# EAGLE design untitled (EAGLE 9.6.2)
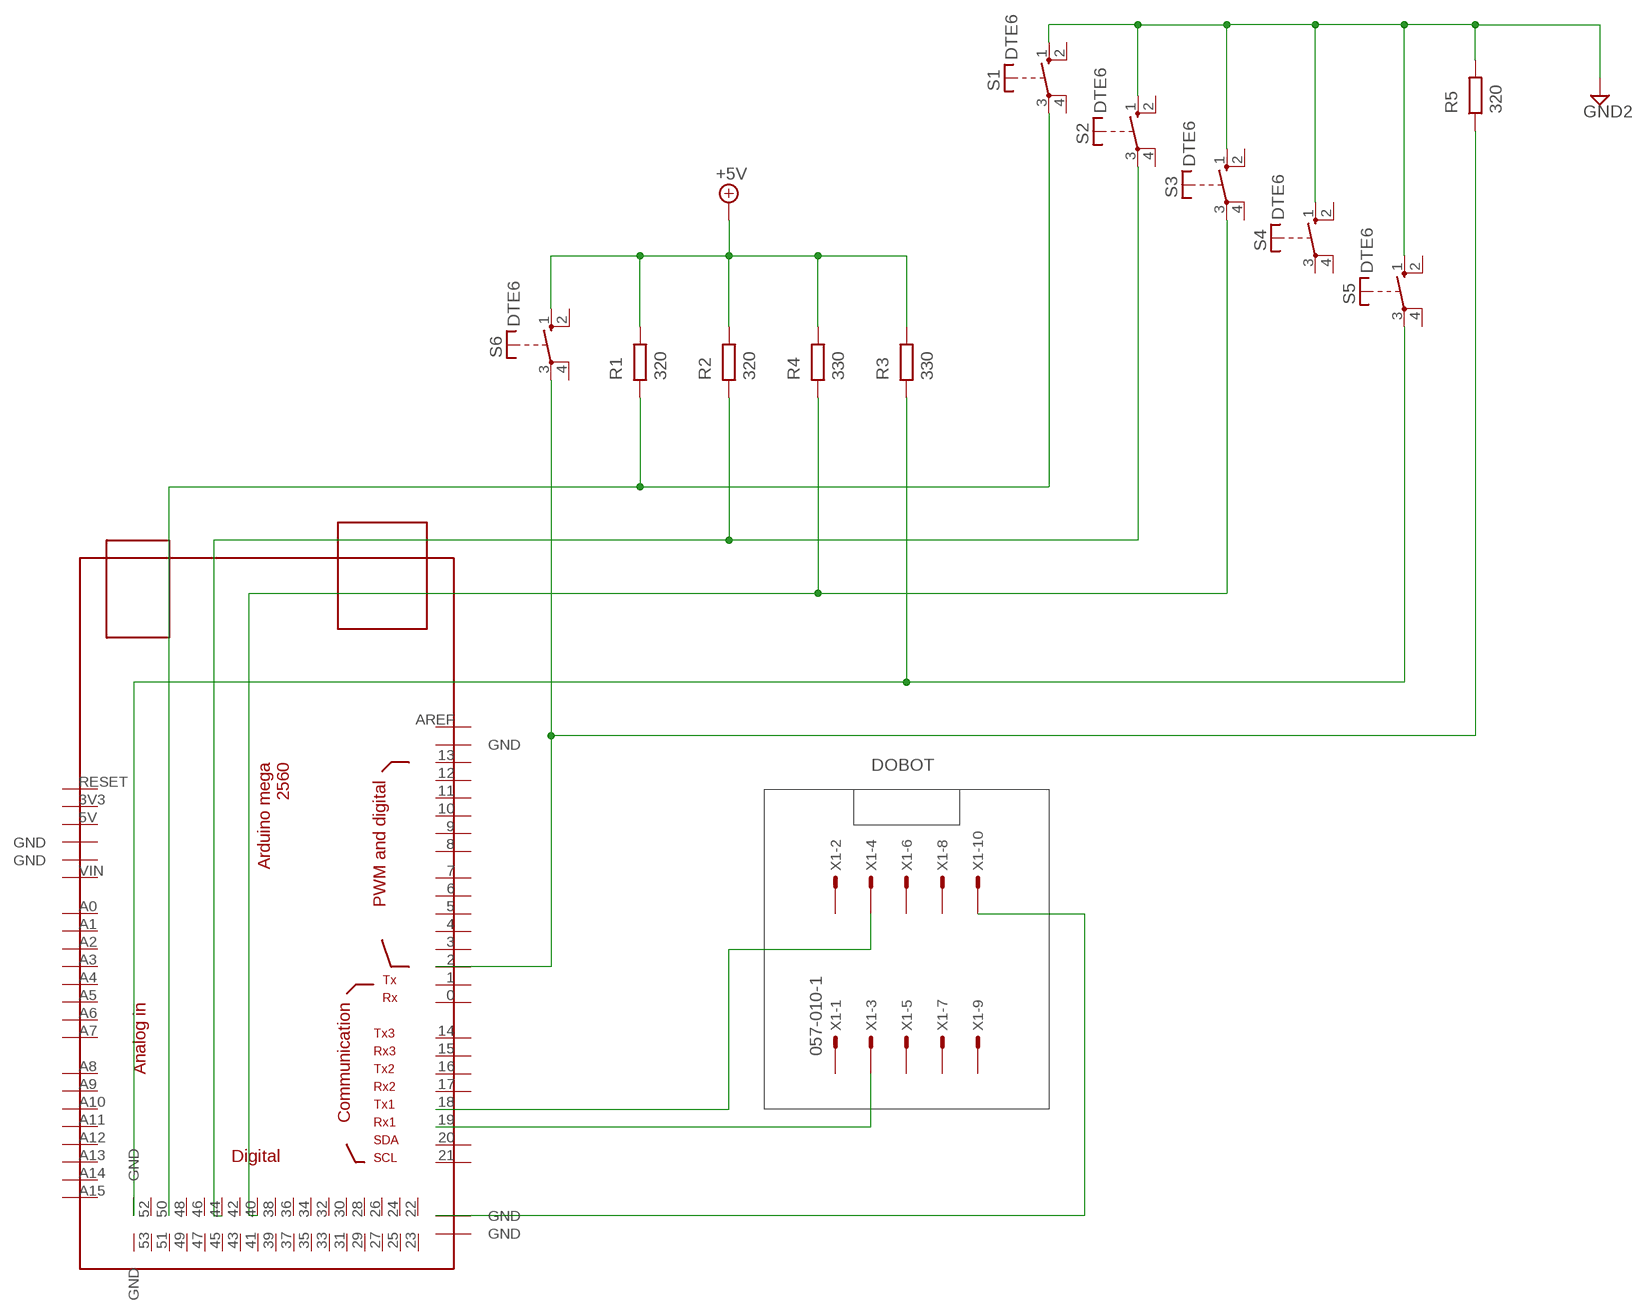
[diagram p0: schematic, sheet 1]

## Parts
R1  320  R  (no package)
R2  320  R  (no package)
R3  330  R  (no package)
R4  330  R  (no package)
R5  320  R  (no package)
S1  DTE6  [DTE6]
S2  DTE6  [DTE6]
S3  DTE6  [DTE6]
S4  DTE6  [DTE6]
S5  DTE6  [DTE6]
S6  DTE6  [DTE6]
U$1  MEGA_DEVICE  [MEGAOUTLINE]
X1  057-010-1  [057-010-1]

## Nets
+5V: R1.2 R2.2 R3.2 R4.2 S6.1(S)
GND2: R5.2 S1.1(S) S2.1(S) S3.1(S) S4.1(S) S5.1(S)
N$1: R1.1 S1.3(P) U$1.50
N$2: U$1.GND@4(GND) X1.10
N$3: U$1.19 X1.3
N$4: U$1.18 X1.4
N$5: R2.1 S2.3(P) U$1.44
N$6: R5.1 S6.3(P) U$1.2
N$7: R4.1 S3.3(P) U$1.40
N$8: R3.1 S5.3(P) U$1.GND@6(GND)
Unconnected: S1.2(S) S1.4(P) S2.2(S) S2.4(P) S3.2(S) S3.4(P) S4.2(S) S4.3(P) S4.4(P) S5.2(S) S5.4(P) S6.2(S) S6.4(P) U$1.0 U$1.1 U$1.3 U$1.3V3 U$1.4 U$1.5 U$1.5V U$1.6 U$1.7 U$1.8 U$1.9 U$1.10 U$1.11 U$1.12 U$1.13 U$1.14 U$1.15 U$1.16 U$1.17 U$1.20 U$1.21 U$1.22 U$1.23 U$1.24 U$1.25 U$1.26 U$1.27 U$1.28 U$1.29 U$1.30 U$1.31 U$1.32 U$1.33 U$1.34 U$1.35 U$1.36 U$1.37 U$1.38 U$1.39 U$1.41 U$1.42 U$1.43 U$1.45 U$1.46 U$1.47 U$1.48 U$1.49 U$1.51 U$1.52 U$1.53 U$1.A0 U$1.A1 U$1.A2 U$1.A3 U$1.A4 U$1.A5 U$1.A6 U$1.A7 U$1.A8 U$1.A9 U$1.A10 U$1.A11 U$1.A12 U$1.A13 U$1.A14 U$1.A15 U$1.AREF U$1.GND@1(GND) U$1.GND@2(GND) U$1.GND@3(GND) U$1.GND@5(GND) U$1.GND@7(GND) U$1.RESET U$1.VIN X1.1 X1.2 X1.5 X1.6 X1.7 X1.8 X1.9

## Notes on the sheet
- DOBOT

## Library data of the parts
R1-R5 = ngspice-simulation:R: RESISTOR
S1-S6 = switch-misc:DT: ITT SWITCH
U$1 = ArduinoMegaOutline:MEGA_DEVICE: mega card as device
X1 = con-panduit:057-010-: CONNECTOR 10-pin series 057 contact pc board low profile headers; OC_FARNELL: unknown; OC_NEWARK: unknown

## Board
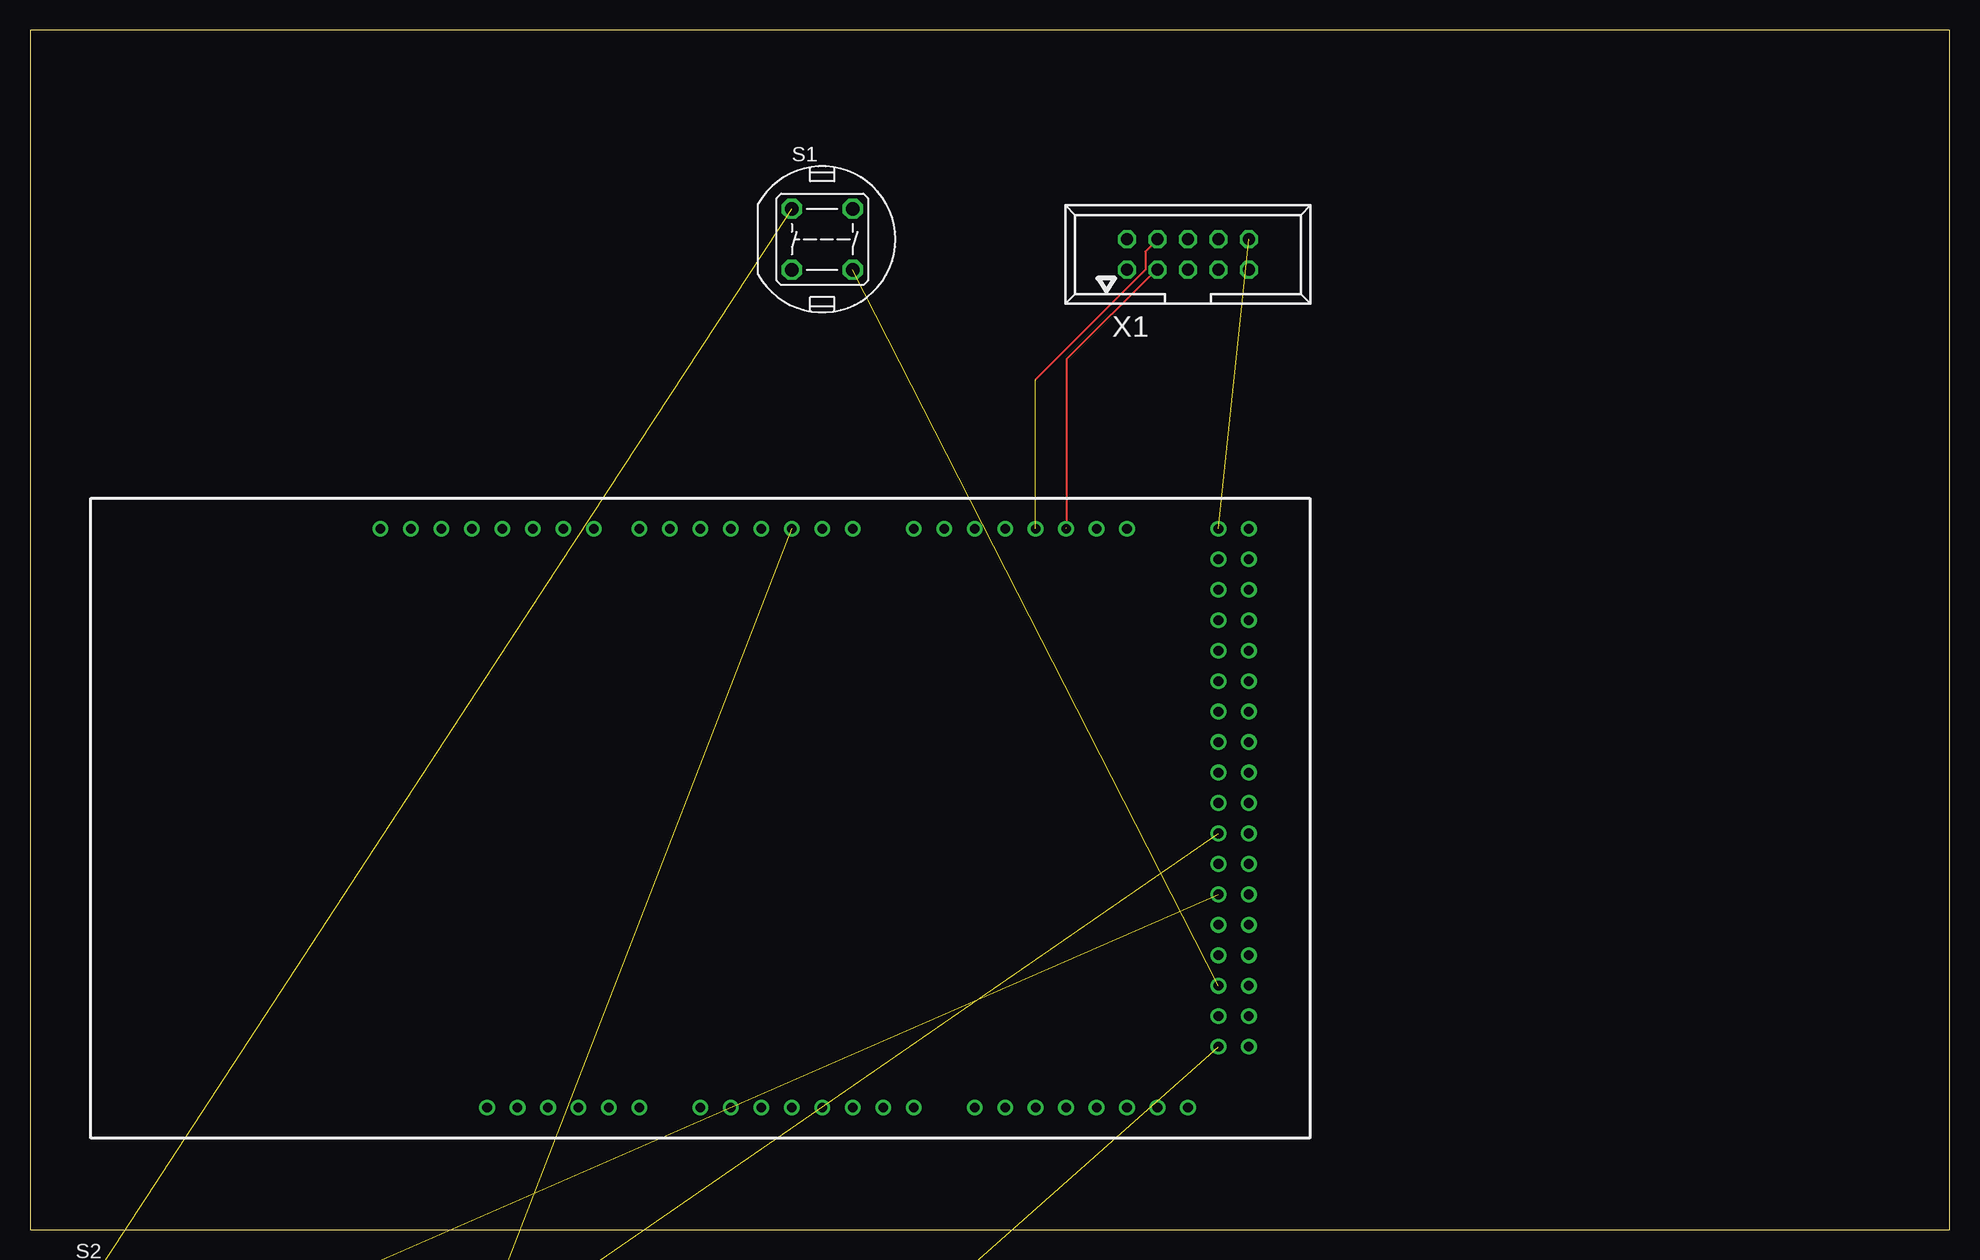
[diagram p1: board, top side]

Size 160 x 100 mm. Coordinates in mm from the lower left corner, seen from the top.
Outline: 0,0 160,0 160,100 0,100 0,0
Copper layers (1*16): Top 0.035mm / dielectric 1.5mm / Bottom 0.035mm
Design rules "default": minimum track width 6mil, minimum drill 0.35mm, track to track 6mil, track to pad 6mil, pad to pad 6mil, via to via 6mil, smd to smd 6mil, copper to edge 40mil, drill to drill 6mil, minimum pad ring 10mil, minimum via ring 8mil, stop-mask expansion 4mil, vias tented up to drill 0mil, thermal gap 10mil

### Footprints (pad centres in the part's own frame; a part is rotated, then mirrored left to right if it is on the bottom)
DTE6 = drill 1.118 octagon: 1 -2.54,2.54; 2 2.54,2.54; 3 2.54,-2.54; 4 -2.54,-2.54
MEGAOUTLINE = drill 0.8: 0 12.7,24.13; 1 10.16,24.13; 2 7.62,24.13; 3 5.08,24.13; 3V3 -15.24,-24.13; 4 2.54,24.13; 5 0,24.13; 5V -12.7,-24.13; 6 -2.54,24.13; 7 -5.08,24.13; 8 -8.89,24.13; 9 -11.43,24.13; 10 -13.97,24.13; 11 -16.51,24.13; 12 -19.05,24.13; 13 -21.59,24.13; 14 17.78,24.13; 15 20.32,24.13; 16 22.86,24.13; 17 25.4,24.13; 18 27.94,24.13; 19 30.48,24.13; 20 33.02,24.13; 21 35.56,24.13; 22 43.18,21.59; 23 45.72,21.59; 24 43.18,19.05; 25 45.72,19.05; 26 43.18,16.51; 27 45.72,16.51; 28 43.18,13.97; 29 45.72,13.97; 30 43.18,11.43; 31 45.72,11.43; 32 43.18,8.89; 33 45.72,8.89; 34 43.18,6.35; 35 45.72,6.35; 36 43.18,3.81; 37 45.72,3.81; 38 43.18,1.27; 39 45.72,1.27; 40 43.18,-1.27; 41 45.72,-1.27; 42 43.18,-3.81; 43 45.72,-3.81; 44 43.18,-6.35; 45 45.72,-6.35; 46 43.18,-8.89; 47 45.72,-8.89; 48 43.18,-11.43; 49 45.72,-11.43; 50 43.18,-13.97; 51 45.72,-13.97; 52 43.18,-16.51; 53 45.72,-16.51; A0 0,-24.13; A1 2.54,-24.13; A2 5.08,-24.13; A3 7.62,-24.13; A4 10.16,-24.13; A5 12.7,-24.13; A6 15.24,-24.13; A7 17.78,-24.13; A8 22.86,-24.13; A9 25.4,-24.13; A10 27.94,-24.13; A11 30.48,-24.13; A12 33.02,-24.13; A13 35.56,-24.13; A14 38.1,-24.13; A15 40.64,-24.13; AREF -26.67,24.13; GND@1 -24.13,24.13; GND@2 -10.16,-24.13; GND@3 -7.62,-24.13; GND@4 43.18,24.13; GND@5 45.72,24.13; GND@6 43.18,-19.05; GND@7 45.72,-19.05; RESET -17.78,-24.13; VIN -5.08,-24.13
057-010-1 = drill 1 octagon: 1 -5.08,-1.27; 2 -5.08,1.27; 3 -2.54,-1.27; 4 -2.54,1.27; 5 0,-1.27; 6 0,1.27; 7 2.54,-1.27; 8 2.54,1.27; 9 5.08,-1.27; 10 5.08,1.27

### Placement (x,y rotation side)
S1  66.04,82.55 0 top
S2  6.35,-8.89 0 top  (outside the outline)
S3  6.35,-26.67 0 top  (outside the outline)
S4  6.35,-44.45 0 top  (outside the outline)
S5  6.35,-62.23 0 top  (outside the outline)
S6  6.35,-80.01 0 top  (outside the outline)
U$1  55.88,34.29 0 top
X1  96.52,81.28 0 top

### Tracks (layer width: path | path; a pad name or v marks a point on that pad's centre or on a via)
GND2  (4 unrouted)
N$1  (1 unrouted)
N$2  (1 unrouted)
N$3  (1 unrouted)
  Top 0.152: 86.41,58.52 86.41,72.54 93.88,80.01 X1.3
N$4  (1 unrouted)
  Top 0.152: 83.82,70.87 92.96,80.01 92.96,81.53 X1.4
N$5  (1 unrouted)
N$6  (1 unrouted)
N$7  (1 unrouted)
N$8  (1 unrouted)